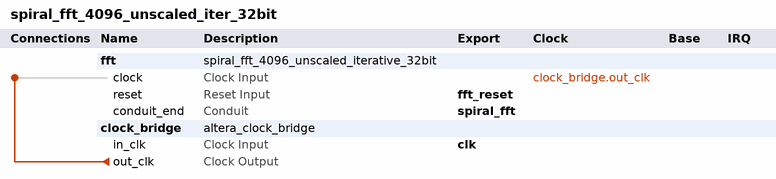
[diagram p0: system contents]
# Platform Designer (Qsys) system spiral_fft_4096_unscaled_iter_32bit, Arria 10 Unknown
# Parameters at their usual value, and those the tool derives, are not listed.
package require -exact qsys 18.1
create_system spiral_fft_4096_unscaled_iter_32bit
set_project_property DEVICE_FAMILY {Arria 10}
set_project_property DEVICE Unknown

add_instance fft spiral_fft_4096_unscaled_iterative_32bit 1.0

add_instance clock_bridge altera_clock_bridge 18.1
set_instance_parameter_value clock_bridge DERIVED_CLOCK_RATE 0
set_instance_parameter_value clock_bridge EXPLICIT_CLOCK_RATE 312500000

# connections
add_connection clock_bridge.out_clk fft.clock clock

# exported interfaces
add_interface clk clock sink
set_interface_property clk EXPORT_OF clock_bridge.in_clk
add_interface fft_reset reset sink
set_interface_property fft_reset EXPORT_OF fft.reset
add_interface spiral_fft conduit end
set_interface_property spiral_fft EXPORT_OF fft.conduit_end

set_interconnect_requirement {$system} qsys_mm.clockCrossingAdapter HANDSHAKE
set_interconnect_requirement {$system} qsys_mm.enableEccProtection FALSE
set_interconnect_requirement {$system} qsys_mm.insertDefaultSlave FALSE
set_interconnect_requirement {$system} qsys_mm.maxAdditionalLatency 1

save_system spiral_fft_4096_unscaled_iter_32bit.qsys
